# EAGLE schematic pcb-pick-plaz-aruco v1 (EAGLE 9.6.2)
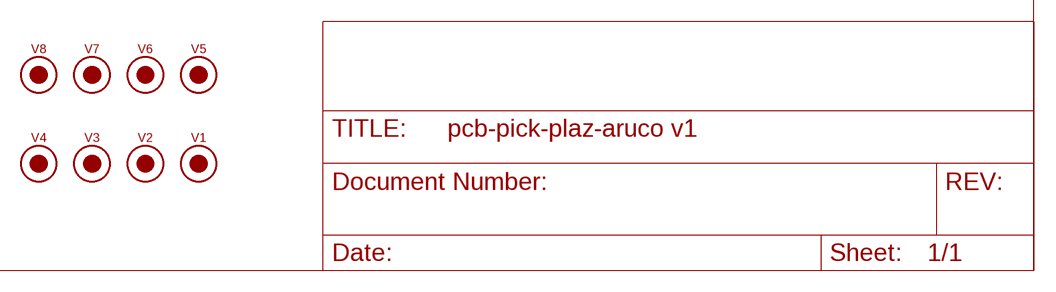
[diagram p0: schematic, sheet 1]

## Parts
V1  FIDUCIAL2MM  [FIDUCIAL_2MM]
V2  FIDUCIAL2MM  [FIDUCIAL_2MM]
V3  FIDUCIAL2MM  [FIDUCIAL_2MM]
V4  FIDUCIAL2MM  [FIDUCIAL_2MM]
V5  FIDUCIAL2MM  [FIDUCIAL_2MM]
V6  FIDUCIAL2MM  [FIDUCIAL_2MM]
V7  FIDUCIAL2MM  [FIDUCIAL_2MM]
V8  FIDUCIAL2MM  [FIDUCIAL_2MM]

## Library data of the parts
V1-V8 = ftobler:FIDUCIAL